# EAGLE design Motor-Shield_v11 (EAGLE 7.5.0)
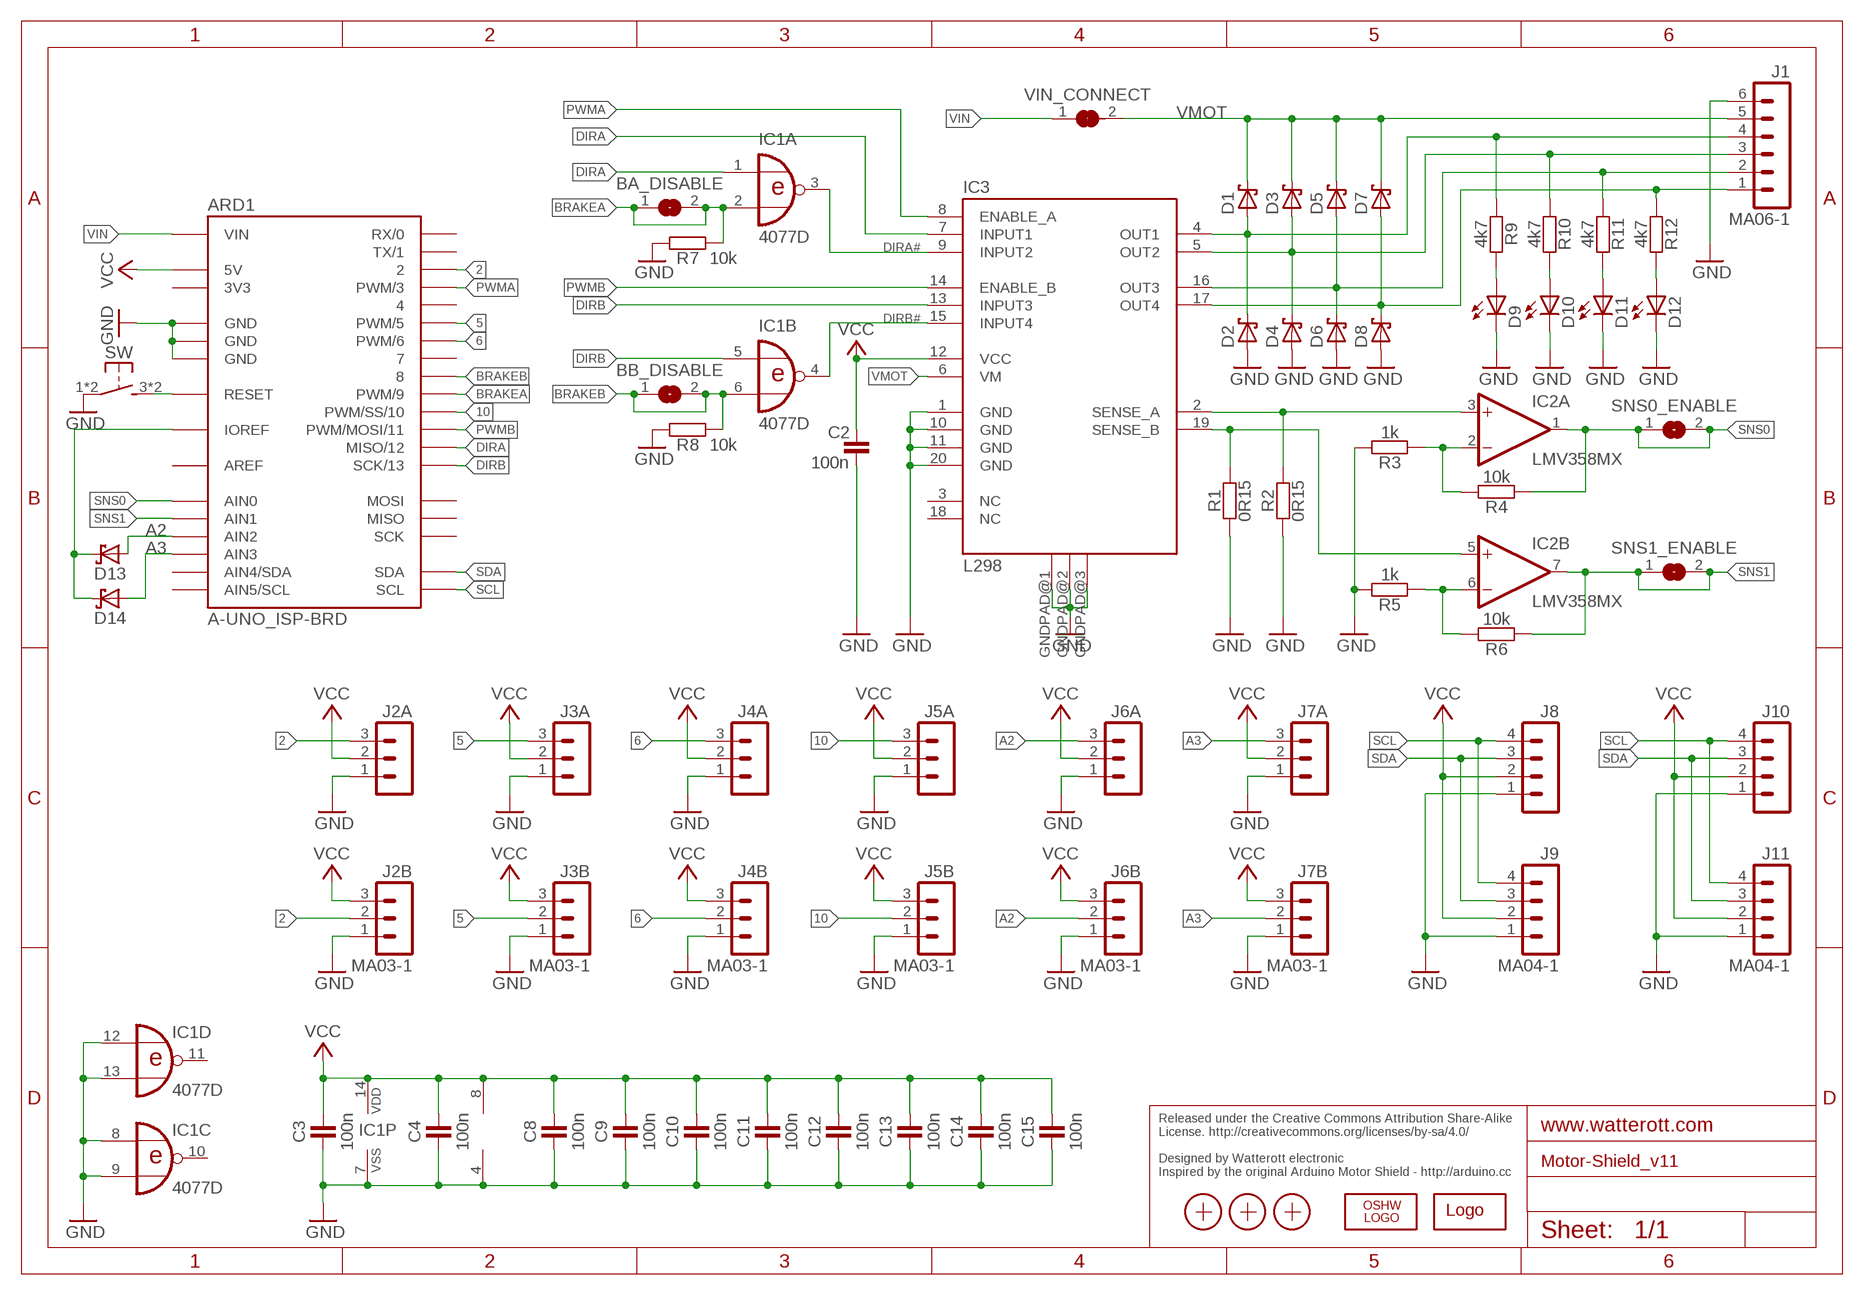
[diagram p0: schematic, sheet 1]

## Parts
ARD1  A-UNO_ISP-BRD  [A-UNO-ISP]
BA_DISABLE  JUMPER2-0603  [JUMPER2-0603]
BB_DISABLE  JUMPER2-0603  [JUMPER2-0603]
C2  100n  CAPACITOR-0402  [C0402]
C3  100n  CAPACITOR-0402  [C0402]
C4  100n  CAPACITOR-0402  [C0402]
C8  100n  CAPACITOR-0402  [C0402]
C9  100n  CAPACITOR-0402  [C0402]
C10  100n  CAPACITOR-0402  [C0402]
C11  100n  CAPACITOR-0402  [C0402]
C12  100n  CAPACITOR-0402  [C0402]
C13  100n  CAPACITOR-0402  [C0402]
C14  100n  CAPACITOR-0402  [C0402]
C15  100n  CAPACITOR-0402  [C0402]
D1  D_SS14  [DO214AC]
D2  D_SS14  [DO214AC]
D3  D_SS14  [DO214AC]
D4  D_SS14  [DO214AC]
D5  D_SS14  [DO214AC]
D6  D_SS14  [DO214AC]
D7  D_SS14  [DO214AC]
D8  D_SS14  [DO214AC]
D9  LED-0603  [C0603]
D10  LED-0603  [C0603]
D11  LED-0603  [C0603]
D12  LED-0603  [C0603]
D13  D_SCHOTTKY-SOD110  [SOD110]
D14  D_SCHOTTKY-SOD110  [SOD110]
IC1  4077D  [SO14]
IC2  LMV358MX  [SO08]
IC3  L298  [POWERSO20]
J1  MA06-1  [MA06-1]
J2A  JST_PH_3B3B-PH-SM4-TB  [JST_B3B-PH-SM4-TB]
J2B  MA03-1  [MA03-1]
J3A  JST_PH_3B3B-PH-SM4-TB  [JST_B3B-PH-SM4-TB]
J3B  MA03-1  [MA03-1]
J4A  JST_PH_3B3B-PH-SM4-TB  [JST_B3B-PH-SM4-TB]
J4B  MA03-1  [MA03-1]
J5A  JST_PH_3B3B-PH-SM4-TB  [JST_B3B-PH-SM4-TB]
J5B  MA03-1  [MA03-1]
J6A  JST_PH_3B3B-PH-SM4-TB  [JST_B3B-PH-SM4-TB]
J6B  MA03-1  [MA03-1]
J7A  JST_PH_3B3B-PH-SM4-TB  [JST_B3B-PH-SM4-TB]
J7B  MA03-1  [MA03-1]
J8  JST_PH_4B4B-PH-SM4-TB  [JST_B4B-PH-SM4-TB]
J9  MA04-1  [MA04-1]
J10  JST_PH_4B4B-PH-SM4-TB  [JST_B4B-PH-SM4-TB]
J11  MA04-1  [MA04-1]
LOGO1  LOGO-S_PLACE_S  [SPARK_TPLACE_S]
LOGO2  OSHW_LOGOX0070  [OSHW_6X70]
R1  0R15  RESISTOR-1206  [C1206]
R2  0R15  RESISTOR-1206  [C1206]
R3  1k  RESISTOR-0402  [C0402]
R4  10k  RESISTOR-0402  [C0402]
R5  1k  RESISTOR-0402  [C0402]
R6  10k  RESISTOR-0402  [C0402]
R7  10k  RESISTOR-0402  [C0402]
R8  10k  RESISTOR-0402  [C0402]
R9  4k7  RESISTOR-0402  [C0402]
R10  4k7  RESISTOR-0402  [C0402]
R11  4k7  RESISTOR-0402  [C0402]
R12  4k7  RESISTOR-0402  [C0402]
SNS0_ENABLE  JUMPER2-0603  [JUMPER2-0603]
SNS1_ENABLE  JUMPER2-0603  [JUMPER2-0603]
SW  SW-TACTILE-6X6_SMD  [SW6X6_SMD]
VIN_CONNECT  JUMPER2-0603  [JUMPER2-0603]
X1  PASSER-07  [PASSER_07MM]
X2  PASSER-07  [PASSER_07MM]
X3  PASSER-07  [PASSER_07MM]

## Nets
2: ARD1.2 J2A.3 J2B.2
5: ARD1.5(PWM/5) J3A.3 J3B.2
6: ARD1.6(PWM/6) J4A.3 J4B.2
10: ARD1.10(PWM/SS/10) J5A.3 J5B.2
A2: ARD1.A2(AIN2) D13.A J6A.3 J6B.2
A3: ARD1.A3(AIN3) D14.A J7A.3 J7B.2
BRAKEA: ARD1.9(PWM/9) BA_DISABLE.1 BA_DISABLE.2 IC1.2(A:I1) R7.1
BRAKEB: ARD1.8 BB_DISABLE.1 BB_DISABLE.2 IC1.6(B:I1) R8.1
DIRA: ARD1.12(MISO/12) IC1.1(A:I0) IC3.7(INPUT1)
DIRA#: IC1.3(A:O) IC3.9(INPUT2)
DIRB: ARD1.13(SCK/13) IC1.5(B:I0) IC3.13(INPUT3)
DIRB#: IC1.4(B:O) IC3.15(INPUT4)
GND: ARD1.GND@1(GND) ARD1.GND@2(GND) ARD1.GND@3(GND) ARD1.GND@4(GND) C2.1 C3.1 C4.1 C8.1 C9.1 C10.1 C11.1 C12.1 C13.1 C14.1 C15.1 D2.1(A) D4.1(A) D6.1(A) D8.1(A) D9.C D10.C D11.C D12.C IC1.7(P:VSS) IC1.8(C:I0) IC1.9(C:I1) IC1.12(D:I0) IC1.13(D:I1) IC2.4(P:V-) IC3.1(GND) IC3.10(GND) IC3.11(GND) IC3.20(GND) IC3.GNDPAD@1(GNDPAD) IC3.GNDPAD@2(GNDPAD) IC3.GNDPAD@3(GNDPAD) J1.6 J2A.1 J2B.1 J3A.1 J3B.1 J4A.1 J4B.1 J5A.1 J5B.1 J6A.1 J6B.1 J7A.1 J7B.1 J8.1 J9.1 J10.1 J11.1 R1.1 R2.1 R3.2 R5.2 R7.2 R8.2 SW.1 SW.2(P1)
IOREF: ARD1.IOREF D13.C D14.C
N$1: D9.A R9.2
N$2: D10.A R10.2
N$3: IC2.2(A:-IN) R3.1 R4.2
N$12: IC2.6(B:-IN) R5.1 R6.2
N$13: D11.A R11.2
N$14: D12.A R12.2
N$19: ARD1.RST@1(RESET) ARD1.RST@2(RESET) SW.3(S1) SW.4(S1)
OUT1: D1.1(A) D2.2(C) IC3.4(OUT1) J1.4 R9.1
OUT2: D3.1(A) D4.2(C) IC3.5(OUT2) J1.3 R10.1
OUT3: D5.1(A) D6.2(C) IC3.16(OUT3) J1.2 R11.1
OUT4: D7.1(A) D8.2(C) IC3.17(OUT4) J1.1 R12.1
PWMA: ARD1.3(PWM/3) IC3.8(ENABLE_A)
PWMB: ARD1.11(PWM/MOSI/11) IC3.14(ENABLE_B)
SCL: ARD1.SCL J8.4 J9.4 J10.4 J11.4
SDA: ARD1.SDA J8.3 J9.3 J10.3 J11.3
SENSE_A: IC2.3(A:+IN) IC3.2(SENSE_A) R2.2
SENSE_B: IC2.5(B:+IN) IC3.19(SENSE_B) R1.2
SNS0: ARD1.A0(AIN0) IC2.1(A:OUT) R4.1 SNS0_ENABLE.1 SNS0_ENABLE.2
SNS1: ARD1.A1(AIN1) IC2.7(B:OUT) R6.1 SNS1_ENABLE.1 SNS1_ENABLE.2
VCC: ARD1.5V ARD1.VCC(5V) C2.2 C3.2 C4.2 C8.2 C9.2 C10.2 C11.2 C12.2 C13.2 C14.2 C15.2 IC1.14(P:VDD) IC2.8(P:V+) IC3.12(VCC) J2A.2 J2B.3 J3A.2 J3B.3 J4A.2 J4B.3 J5A.2 J5B.3 J6A.2 J6B.3 J7A.2 J7B.3 J8.2 J9.2 J10.2 J11.2
VIN: ARD1.VIN VIN_CONNECT.1
VMOT: D1.2(C) D3.2(C) D5.2(C) D7.2(C) IC3.6(VM) J1.5 VIN_CONNECT.2
Unconnected: ARD1.0(RX/0) ARD1.1(TX/1) ARD1.4 ARD1.7 ARD1.A4(AIN4/SDA) ARD1.A5(AIN5/SCL) ARD1.MISO ARD1.MOSI ARD1.SCK IC1.10(C:O) IC1.11(D:O) IC3.3(NC) IC3.18(NC)

## Notes on the sheet
- Released under the Creative Commons Attribution Share-Alike 
  License. http://creativecommons.org/licenses/by-sa/4.0/
  
  Designed by Watterott electronic
  Inspired by the original Arduino Motor Shield - http://arduino.cc

## Power pins joined to a net without a drawn wire
3V3: ARD1.3V3
AREF: ARD1.AREF

## Library data of the parts
ARD1 = we-board:A-UNO_ISP: Arduino Uno with ISP connector
BA_DISABLE BB_DISABLE SNS0_ENABLE SNS1_ENABLE VIN_CONNECT = we-rcl:JUMPER2: 2 Pin Jumpers
C2-C4 C8-C15 = we-rcl:CAPACITOR: Capacitors ...4.7uF @ 6.3V -> 0402 ...10uF @ 16V -> 0603 ...22uF @ 25V -> 0805
D1-D8 = we-rcl:D_SS14: DIODE schottky
D9-D12 = we-opto:LED: LEDs red, green, blue -> 0603
D13 D14 = we-rcl:D_SCHOTTKY: Schottky Diodes
IC1 = 40xx:4077: Quad XNOR
IC2 = linear:LMV358?*: Dual General Purpose, Low Voltage, Rail-to-Rail Output Operational Amplifiers Source: http://www.national.com/mpf/LM/LMV321.html http://www.national.com/dt/lmv_qual.pdf
IC3 = we-chip:L298: ST L298 Dual Full Bridge Driver (up to 46V and 4A)
J1 = we-con:MA06-1: Pin Header
J2A J3A J4A J5A J6A J7A = we-con:JST_PH_3: JST Connector
J2B J3B J4B J5B J6B J7B = we-con:MA03-1: Pin Header
J8 J10 = we-con:JST_PH_4: JST Connector
J9 J11 = we-con:MA04-1: Pin Header
LOGO1 = we-symbol:LOGO: Watterott electronic Logo
LOGO2 = we-symbol:OSHW_LOGO: Open-Source-Hardware Logo
R1-R12 = we-rcl:RESISTOR: Resistors all kinds in 0603 and 0402
SW = we-switch:SW-TACTILE: Tactile Switches
X1-X3 = we-symbol:PASSER: Fiducial Markers

## Board
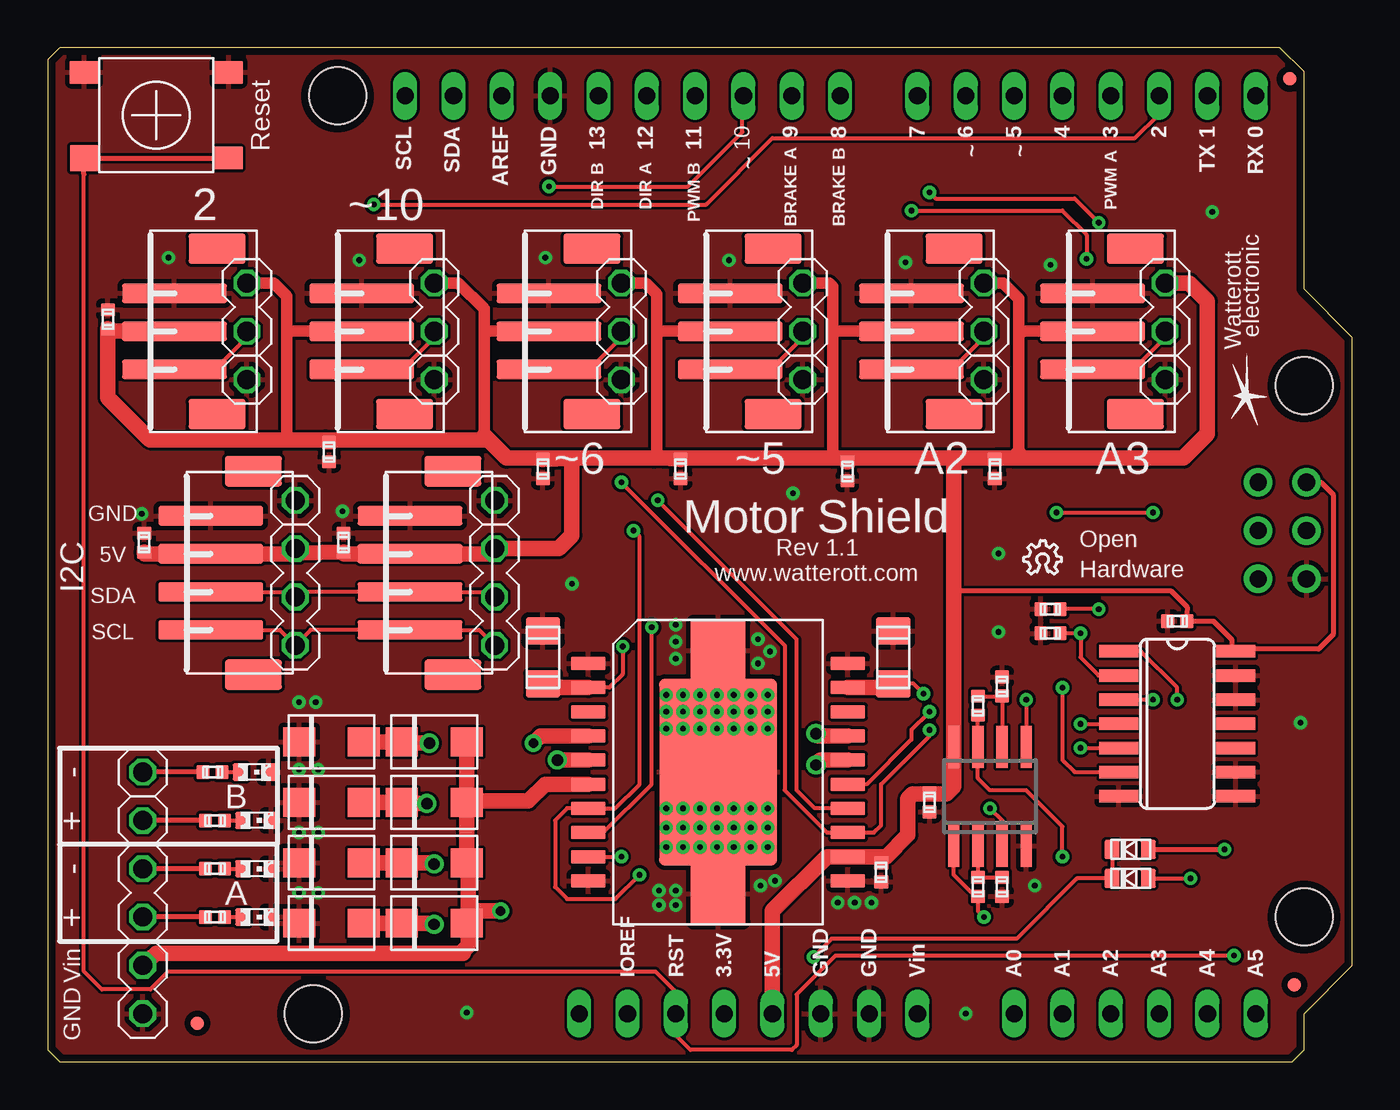
[diagram p1: board, top side]
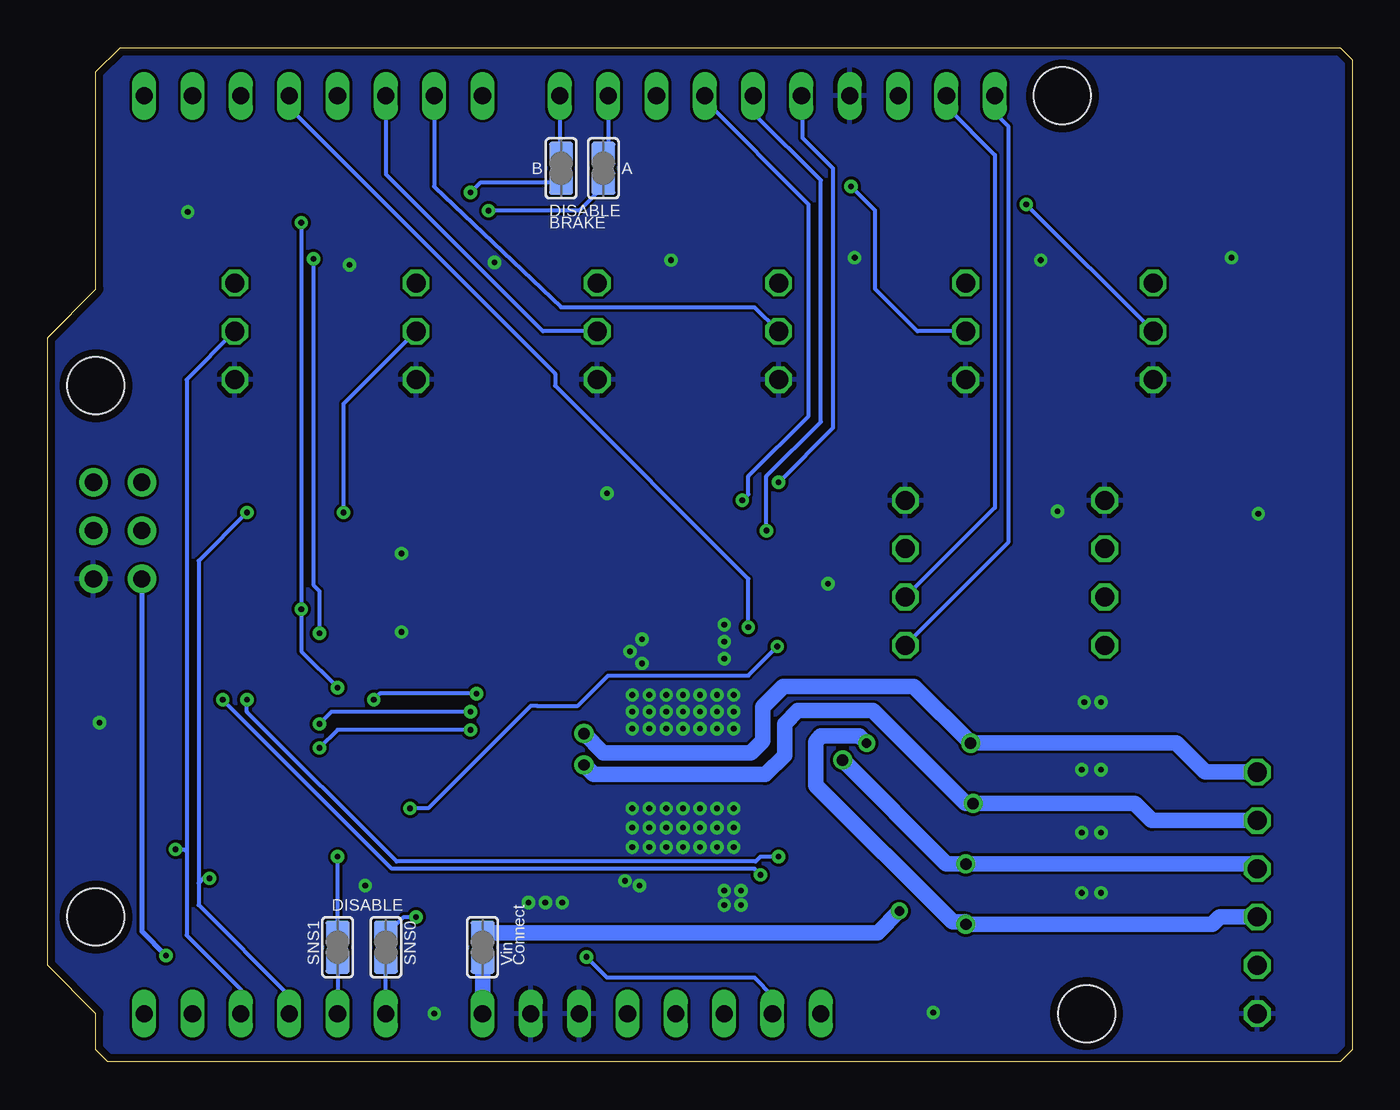
[diagram p2: board, bottom side, seen from below]

Size 68.58 x 53.34 mm. Coordinates in mm from the lower left corner, seen from the top.
Copper layers (1*16): Top 0.035mm / dielectric 1.5mm / Bottom 0.035mm
Design rules "we-dru-2-layer": minimum track width 0.15mm, minimum drill 0.3mm, track to track 0.15mm, track to pad 0.15mm, pad to pad 0.15mm, via to via 0.15mm, smd to smd 0.1mm, copper to edge 0.4mm, drill to drill 0.2mm, minimum pad ring 0.18mm, minimum via ring 0.2mm, stop-mask expansion 0.1mm, vias tented up to drill 0.5mm, thermal gap 0.25mm

### Footprints (pad centres in the part's own frame; a part is rotated, then mirrored left to right if it is on the bottom)
A-UNO-ISP = drill 0.9 pad 1.2 long: 0 63.5,50.8; 1 60.96,50.8; 2 58.42,50.8; 3 55.88,50.8; 3V3 35.56,2.54; 4 53.34,50.8; 5 50.8,50.8; 5V 38.1,2.54; 6 48.26,50.8; 7 45.72,50.8; 8 41.656,50.8; 9 39.116,50.8; 10 36.576,50.8; 11 34.036,50.8; 12 31.496,50.8; 13 28.956,50.8; A0 50.8,2.54; A1 53.34,2.54; A2 55.88,2.54; A3 58.42,2.54; A4 60.96,2.54; A5 63.5,2.54; AREF 23.876,50.8; GND@1 40.64,2.54; GND@2 43.18,2.54; GND@3 26.416,50.8; IOREF 30.48,2.54; NC 27.94,2.54; RST@1 33.02,2.54; SCL 18.796,50.8; SDA 21.336,50.8; VIN 45.72,2.54 | drill 0.9 pad 1.5: GND@4 66.167,25.4; MISO 63.627,30.48; MOSI 66.167,27.94; RST@2 63.627,25.4; SCK 63.627,27.94; VCC 66.167,30.48 | hole 3: 66.04,35.56; 66.04,7.62; 15.24,50.8; 13.97,2.54
JUMPER2-0603 = smd 1.25 x 1.25: 1 0,0.76; 2 0,-0.76
C0402 = smd 0.75 x 0.7: 1 0,0.5; 2 0,-0.5
DO214AC = smd 1.68 x 1.52: 1 -1.7,0; 2 1.7,0
C0603 = smd 0.9 x 0.8: A 0,-0.75; C 0,0.75
SOD110 = smd 1 x 0.8: A 0,-0.95; C 0,0.95
SO14 = smd 0.66 x 2.032: 1 -3.81,-3.073; 2 -2.54,-3.073; 3 -1.27,-3.073; 4 0,-3.073; 5 1.27,-3.073; 6 2.54,-3.073; 7 3.81,-3.073; 8 3.81,3.073; 9 2.54,3.073; 10 1.27,3.073; 11 0,3.073; 12 -1.27,3.073; 13 -2.54,3.073; 14 -3.81,3.073
SO08 = smd 0.6 x 2.2: 1 -1.905,-2.6; 2 -0.635,-2.6; 3 0.635,-2.6; 4 1.905,-2.6; 5 1.905,2.6; 6 0.635,2.6; 7 -0.635,2.6; 8 -1.905,2.6
POWERSO20 = smd 1.8 x 0.7: 1 -6.82,5.715; 2 -6.82,4.445; 3 -6.82,3.175; 4 -6.82,1.905; 5 -6.82,0.635; 6 -6.82,-0.635; 7 -6.82,-1.905; 8 -6.82,-3.175; 9 -6.82,-4.445; 10 -6.82,-5.715; 11 6.82,-5.715; 12 6.82,-4.445; 13 6.82,-3.175; 14 6.82,-1.905; 15 6.82,-0.635; 16 6.82,0.635; 17 6.82,1.905; 18 6.82,3.175; 19 6.82,4.445; 20 6.82,5.715 | smd 2.9 x 3.25: GNDPAD@1 0,6.4; GNDPAD@3 0,-6.4 | smd 6.2 x 9.8: GNDPAD@2 0,0
MA06-1 = drill 1 octagon: 1 0,6.35; 2 0,3.81; 3 0,1.27; 4 0,-1.27; 5 0,-3.81; 6 0,-6.35
JST_B3B-PH-SM4-TB = smd 5.5 x 1: 1 0,2; 2 0,0; 3 0,-2 | smd 3 x 1.6: SHLD1 2.25,4.35; SHLD2 2.25,-4.35
MA03-1 = drill 1 octagon: 1 0,2.54; 2 0,0; 3 0,-2.54
JST_B4B-PH-SM4-TB = smd 5.5 x 1: 1 0,3; 2 0,1; 3 0,-1; 4 0,-3 | smd 3 x 1.6: SHLD1 2.25,5.35; SHLD2 2.25,-5.35
MA04-1 = drill 1 octagon: 1 0,3.81; 2 0,1.27; 3 0,-1.27; 4 0,-3.81
C1206 = smd 1.8 x 1.45: 1 0,1.4; 2 0,-1.4
SW6X6_SMD = smd 1.5 x 1.2: 1 -3.8,2.25; 2 3.8,2.25; 4 3.8,-2.25 | smd 1.5 x 1.4: 3 -3.8,-2.25
PASSER_07MM = smd 0.7 x 0.7: X 0,0

### Placement (x,y rotation side)
ARD1  0,0 0 top
BA_DISABLE  39.37,46.99 180 bottom
BB_DISABLE  41.59,46.99 0 bottom
C2  43.81,9.97 180 top
C3  59.37,23.18 90 top
C4  46.35,13.65 180 top
C8  26.04,31.18 180 top
C9  33.27,31.18 180 top
C10  42.04,31.05 180 top
C11  49.78,31.18 180 top
C12  5.08,27.3 0 top
C13  15.56,27.3 0 top
C14  14.8,32.07 180 top
C15  3.17,39.05 0 top
D1  20.32,7.3 0 top
D2  14.92,7.3 0 top
D3  20.32,10.48 0 top
D4  14.92,10.48 0 top
D5  20.32,13.65 0 top
D6  14.92,13.65 0 top
D7  20.32,16.83 0 top
D8  14.92,16.83 0 top
D9  11,7.62 270 top
D10  11,10.16 270 top
D11  11,12.7 270 top
D12  10.87,15.24 270 top
D13  56.9,9.65 90 top
D14  56.9,11.18 90 top
IC1  59.37,17.78 270 top
IC2  49.53,13.97 0 top
IC3  35.24,15.24 0 top
J1  5,8.89 0 top
J2A  6.67,38.42 0 top
J2B  10.48,38.42 180 top
J3A  35.88,38.42 0 top
J3B  39.69,38.42 180 top
J4A  26.35,38.42 0 top
J4B  30.16,38.42 180 top
J5A  16.51,38.42 0 top
J5B  20.32,38.42 180 top
J6A  45.4,38.42 0 top
J6B  49.21,38.42 180 top
J7A  54.93,38.42 0 top
J7B  58.74,38.42 180 top
J8  8.57,25.72 0 top
J9  13.02,25.72 0 top
J10  19.05,25.72 0 top
J11  23.5,25.72 0 top
LOGO1  62.99,35.05 90 top
LOGO2  51.31,25.65 0 top
R1  44.45,21.27 0 top
R2  26.04,21.27 0 top
R3  50.16,9.21 0 top
R4  48.9,9.21 180 top
R5  50.16,19.75 180 top
R6  48.9,18.73 180 top
R7  52.7,22.54 270 top
R8  52.7,23.81 270 top
R9  8.8,7.62 90 top
R10  8.8,10.16 90 top
R11  8.8,12.7 90 top
R12  8.67,15.24 90 top
SNS0_ENABLE  50.8,6.03 0 bottom
SNS1_ENABLE  53.34,6.03 0 bottom
SW  5.71,49.78 0 top
VIN_CONNECT  45.72,6.03 180 bottom
X1  7.87,2.03 0 top
X2  65.53,4.06 0 top
X3  65.28,51.69 0 top

### Tracks (layer width: path | path; a pad name or v marks a point on that pad's centre or on a via)
2  (via drill 0.3)
  Top 0.2: v17.14,45.09 34.61,45.09 38.1,48.58 57.15,48.58 58.42,49.85 ARD1.2 | J2A.3 8.79,36.42 10.16,37.78 10.16,38.1 J2B.2
  Bottom 0.2: J2B.2 v17.14,45.09
5
  Top 0.2: J3A.3 38.01,36.42 39.37,37.78 39.37,38.1 J3B.2
  Bottom 0.2: ARD1.5 50.8,46.67 42.55,38.42 J3B.2
6
  Top 0.2: J4A.3 28.48,36.42 29.84,37.78 29.84,38.1 J4B.2
  Bottom 0.2: ARD1.6 48.26,46.04 41.59,39.69 31.43,39.69 J4B.2
10  (via drill 0.3)
  Top 0.2: v26.35,46.04 33.66,46.04 36.51,48.9 36.51,50.74 ARD1.10 | J5A.3 18.64,36.42 20,37.78 20,38.1 J5B.2
  Bottom 0.2: v26.35,46.04 25.08,44.77 25.08,40.64 22.86,38.42 J5B.2
A2  (via drill 0.3)
  Top 0.2: v53.02,28.89 v58.1,28.89 | J6A.3 47.53,36.42 48.9,37.78 48.9,38.1 J6B.2 | D13.A v60.07,9.65
  Bottom 0.2: v58.1,28.89 60.64,26.35 60.64,9.4 | 60.64,9.4 60.64,8.26 55.88,3.49 ARD1.A2 | v53.02,28.89 53.02,34.61 J6B.2 | v60.07,9.65 60.39,9.65 60.64,9.4
A3  (via drill 0.3)
  Top 0.2: J7A.3 57.05,36.42 58.42,37.78 58.42,38.1 J7B.2
  Top 0.254: D14.A v61.85,11.18
  Bottom 0.2: 61.28,11.05 61.28,35.88 J7B.2 | 61.28,11.05 61.28,6.67 58.42,3.81 ARD1.A3 | v61.85,11.18 61.4,11.18 61.28,11.05
BRAKEA  (via drill 0.3)
  Top 0.2: v45.4,44.77 53.34,44.77 54.61,43.5 v54.61,42.23 | IC1.2 55.24,20.32 54.29,21.27 v54.29,22.54 R7.1
  Bottom 0.2: ARD1.9 39.12,48 BA_DISABLE.2 BA_DISABLE.1 39.37,46.04 40.64,44.77 v45.4,44.77 | v54.61,42.23 54.61,25.08 54.29,24.77 v54.29,22.54
BRAKEB  (via drill 0.3)
  Top 0.2: v46.35,45.72 46.67,45.4 53.98,45.4 v55.24,44.13 | v53.34,19.68 53.34,15.88 53.98,15.24 IC1.6 | v55.24,23.81 R8.1
  Bottom 0.2: ARD1.8 41.66,47.81 BB_DISABLE.1 BB_DISABLE.2 45.84,46.23 v46.35,45.72 | v55.24,44.13 v55.24,23.81 55.24,21.59 v53.34,19.68
DIRA  (via drill 0.3)
  Top 0.2: v31.11,9.84 29.84,8.57 27.3,8.57 26.67,9.21 26.67,12.7 27.3,13.34 IC3.7 29.84,13.34 31.11,14.61 31.11,27.62 v30.8,27.94 | v59.37,19.05 59.37,19.68 57.47,21.59 IC1.1
  Bottom 0.2: v31.11,9.84 31.43,10.16 50.48,10.16 v59.37,19.05 | v30.8,27.94 30.8,30.8 27.94,33.66 27.94,46.35 31.43,49.85 31.43,50.74 ARD1.12
DIRA#  (via drill 0.3)
  Top 0.2: IC3.9 v30.16,10.79 | v58.1,19.05 IC1.3
  Bottom 0.2: v58.1,19.05 58.1,18.41 50.23,10.54 31.37,10.54 31.11,10.79 v30.16,10.79
DIRB  (via drill 0.3)
  Top 0.2: v46.35,17.46 46.35,17.14 43.81,14.61 43.81,12.45 43.43,12.06 IC3.13 40.96,12.06 38.73,14.29 38.73,21.91 v30.16,30.48 | v54.29,16.51 IC1.5
  Bottom 0.2: v46.35,17.46 53.34,17.46 v54.29,16.51 | v30.16,30.48 27.3,33.34 27.3,46.99 28.89,48.58 28.89,50.74 ARD1.13
DIRB#  (via drill 0.3)
  Top 0.2: v46.35,18.41 45.4,17.46 45.4,16.95 43.05,14.61 IC3.15 | v54.29,17.78 IC1.4
  Bottom 0.2: v46.35,18.41 53.66,18.41 v54.29,17.78
GND  (via drill 0.3)
  other vias: 13.21,18.92 14.1,18.92 13.21,15.37 14.22,15.37 13.21,12.06 14.22,12.06 13.21,8.89 14.22,8.89 33.02,9.02 33.02,8.26 37.47,9.27 32.13,9.02 32.13,8.26 38.23,9.53 41.53,8.38 42.42,8.38 43.31,8.38 33.02,21.21 33.02,22.1 33.02,22.99 37.34,22.23 37.34,20.95 37.97,21.59 32.51,11.3 33.4,11.3 34.29,11.3 35.18,11.3 36.07,11.3 36.96,11.3 37.85,11.3 32.51,12.32 33.4,12.32 34.29,12.32 35.18,12.32 36.07,12.32 36.96,12.32 37.85,12.32 32.51,13.34 33.4,13.34 34.29,13.34 35.18,13.34 36.07,13.34 36.96,13.34 37.85,13.34 32.51,19.3 33.4,19.3 34.29,19.3 35.18,19.3 36.07,19.3 36.96,19.3 37.85,19.3 32.51,18.41 33.4,18.41 34.29,18.41 35.18,18.41 36.07,18.41 36.96,18.41 37.85,18.41 32.51,17.53 33.4,17.53 34.29,17.53 35.18,17.53 36.07,17.53 36.96,17.53 37.85,17.53 4.95,28.83 15.49,28.96 6.35,42.29 16.38,42.16 26.16,42.29 35.81,42.16 45.09,42.04 52.7,41.91 39.18,29.91 49.97,26.73 49.97,22.61 65.85,17.84 22.03,2.6 61.21,44.7 51.88,9.27 27.56,25.15 48.26,2.54
  pour Bottom: 0.64,53.34 64.77,53.34 66.04,52.07 66.04,40.64 68.58,38.1 68.58,5.08 66.04,2.54 66.04,0.64 65.41,0 0.64,0 0,0.64 0,52.7
  pour Top: 0.64,53.34 64.77,53.34 66.04,52.07 66.04,40.64 68.58,38.1 68.58,5.08 66.04,2.54 66.04,0.64 65.41,0 0.64,0 0,0.64 0,52.7
IOREF  (via drill 0.3)
  Top 0.2: D14.C D13.C 54.1,9.65 50.93,6.48 41.21,6.48 v40.26,5.52
  Bottom 0.2: v40.26,5.52 39.18,4.45 31.43,4.45 30.48,3.49 ARD1.IOREF
N$1
  Top 0.2: R9.2 D9.A
N$2
  Top 0.2: R10.2 D10.A
N$3
  Top 0.2: IC2.2 R4.2 R3.1
N$10
  Bottom 0.61: 45.72,6.67 45.72,5.4
N$12
  Top 0.2: IC2.6 R5.1 50.15,19.23 R6.2
N$13
  Top 0.2: R11.2 D11.A
N$14
  Top 0.2: R12.2 D12.A
N$19  (via drill 0.3)
  Top 0.2: 1.91,46.67 1.91,4.76 2.86,3.81 5.4,3.81 6.35,4.76 31.94,4.76 33.02,3.68 ARD1.RST@1 33.02,1.4 33.78,0.64 39.12,0.64 39.37,0.89 39.37,3.56 41.4,5.59 v62.36,5.59
  Top 0.254: 1.91,46.67 1.91,47.52 SW.3 SW.4
  Bottom 0.254: ARD1.RST@2 63.63,6.86 v62.36,5.59
OUT1  (via drill 0.5, 0.6)
  Top 0.254: R9.1 J1.4
  Top 0.813: D2.2 D1.1 20.26,7.3 v20.32,7.24 | IC3.4 25.91,17.14 v25.53,16.76
  Bottom 0.813: J1.4 6.99,7.62 7.37,7.24 v20.32,7.24 20.32,7.37 21.02,7.37 28.19,14.54 28.19,16.83 27.94,17.14 25.91,17.14 v25.53,16.76
OUT2  (via drill 0.6)
  Top 0.254: R10.1 J1.3
  Top 0.813: D4.2 D3.1 20.26,10.48 v20.32,10.41 | IC3.5 v26.8,15.88
  Bottom 0.813: J1.3 5.25,10.41 v20.32,10.41 21.34,10.41 v26.8,15.88
OUT3  (via drill 0.6)
  Top 0.254: R11.1 J1.2
  Top 0.813: D6.2 D5.1 18.68,13.59 v19.94,13.59 | IC3.16 40.64,15.88 v40.39,15.62
  Bottom 0.813: J1.2 10.54,12.7 11.43,13.59 v19.94,13.59 20.32,13.59 25.21,18.48 29.15,18.48 29.84,17.78 29.84,16.13 30.86,15.11 39.88,15.11 v40.39,15.62
OUT4  (via drill 0.6)
  Top 0.254: R12.1 J1.1
  Top 0.813: D8.2 D7.1 18.68,16.76 v20.07,16.76 | IC3.17 40.51,17.14 v40.39,17.27
  Bottom 0.813: J1.1 7.75,15.24 9.27,16.76 v20.07,16.76 23.05,19.75 29.91,19.75 30.99,18.67 30.99,16.89 31.62,16.26 39.37,16.26 v40.39,17.27
PWMA  (via drill 0.3)
  Top 0.2: IC3.8 29.21,12.06 31.75,14.61 v31.75,22.86
  Bottom 0.2: ARD1.3 55.88,50.16 41.91,36.2 41.91,35.56 31.75,25.4 v31.75,22.86
PWMB  (via drill 0.3)
  Top 0.2: IC3.14 40.32,13.34 39.37,14.29 39.37,22.23 v32.07,29.53
  Bottom 0.2: v32.07,29.53 31.75,29.84 31.75,30.8 28.57,33.97 28.57,45.09 33.97,50.48 33.97,50.74 ARD1.11
SCL
  Top 0.2: J8.4 12.21,22.72 J9.4 13.83,22.72 J10.4 22.68,22.72 J11.4
  Bottom 0.2: J11.4 18.1,27.3 18.1,49.21 18.73,49.85 18.73,50.74 ARD1.SCL
SDA
  Top 0.2: J8.3 12.75,24.72 J9.3 13.29,24.72 J10.3 23.23,24.72 J11.3
  Bottom 0.2: 21.27,50.8 ARD1.SDA 21.27,50.74 21.27,50.16 18.8,47.69 18.8,29.15 J11.3
SENSE_A  (via drill 0.3)
  Top 0.2: 29.21,19.68 IC3.2 29.53,19.68 30.23,20.38 v30.23,21.84 | v49.53,13.34 50.16,12.7 IC2.3
  Top 0.813: IC3.2 26.27,19.68 R2.2
  Bottom 0.2: v49.53,13.34 48.58,13.34 43.18,18.73 42.86,18.73 40.7,18.73 39.12,20.32 31.75,20.32 v30.23,21.84
SENSE_B  (via drill 0.3)
  Top 0.2: R1.2 45.48,19.92 v46.04,19.37 | v51.44,19.05 IC2.5
  Top 0.813: IC3.19 44.21,19.68 R1.2
  Bottom 0.2: v46.04,19.37 51.12,19.37 v51.44,19.05
SNS0  (via drill 0.3)
  Top 0.2: IC2.1 47.62,9.84 48.81,8.66 R4.1 48.9,7.94 v49.21,7.62
  Bottom 0.2: ARD1.A0 SNS0_ENABLE.2 SNS0_ENABLE.1 50.67,6.79 49.85,7.62 v49.21,7.62
SNS1  (via drill 0.3)
  Top 0.2: R6.1 IC2.7 48.9,14.92 49.53,14.29 51.44,14.29 53.34,12.38 v53.34,10.79
  Bottom 0.2: ARD1.A1 SNS1_ENABLE.2 SNS1_ENABLE.1 v53.34,10.79
VCC
  Top 0.2: 47.94,24.77 47.62,25.08 | C4.2 45.9,14.15 45.85,14.1 | C2.2 43.81,10.67 43.94,10.79
  Top 0.254: 47.94,24.77 59.05,24.77 59.92,23.9 C3.2 61.28,23.18 62.23,22.23 62.23,21.81 IC1.14 62.57,21.72 66.8,21.72 67.56,22.48 67.56,29.84 66.93,30.48 ARD1.VCC
  Top 0.406: C14.2 14.61,32.57 14.61,32.7
  Top 0.61: 22.95,32.94 22.95,38.42 | 22.95,38.42 22.95,39.6 21.59,40.96 J5B.3 | J4A.2 22.95,38.42 | J3A.2 32.19,38.42 32,38.23 | 32,38.23 32,31.88 31.88,31.75 | J4B.3 31.43,40.96 32,40.39 32,38.23 | J3B.3 41.08,40.96 41.27,40.77 41.27,38.48 | 41.27,38.48 41.27,31.75 | J6A.2 41.34,38.42 41.27,38.48 | 49.76,31.75 C11.2 49.81,31.75 | J6B.3 50.23,40.96 51.05,40.13 51.05,38.23 | 51.05,38.23 51.05,32 | J7A.2 51.24,38.42 51.05,38.23 | J2B.3 11.87,40.96 12.57,40.26 12.57,38.35 | 12.57,38.35 12.57,32.7 | J5A.2 12.64,38.42 12.57,38.35
  Top 0.813: ARD1.5V 38.1,7.94 40.96,10.79 IC3.12 43.94,10.79 44.07,10.79 45.21,11.94 45.21,13.84 45.47,14.1 45.85,14.1 47.24,14.1 47.62,14.48 IC2.8 47.62,25.08 47.62,31.75 | 6.58,38.5 J2A.2 3.26,38.42 C15.2 3.17,34.92 5.4,32.7 12.57,32.7 14.61,32.7 23.18,32.7 | C12.2 5.12,26.72 J8.2 12.75,26.72 J9.2 13.25,26.75 C13.2 15.6,26.72 J10.2 23.23,26.72 J11.2 26.86,26.99 27.56,27.69 27.56,31.62 27.69,31.75 | 47.62,31.75 41.91,31.75 | 41.91,31.75 41.27,31.75 32.38,31.75 | 32.38,31.75 31.88,31.75 27.69,31.75 | 27.69,31.75 27.56,31.75 | 27.56,31.75 24.13,31.75 23.18,32.7 | C10.2 41.91,31.75 | C9.2 32.38,31.75 | 22.95,32.94 23.18,32.7 | 47.62,31.75 49.76,31.75 | 50.8,31.75 49.81,31.75 | C8.2 27.54,31.73 27.56,31.75 | 50.8,31.75 59.69,31.75 60.96,33.02 60.96,40.01 60.01,40.96 J7B.3 | 51.05,32 50.8,31.75
VIN
  Bottom 0.813: ARD1.VIN VIN_CONNECT.1
VMOT  (via drill 0.5)
  Top 0.813: J1.5 5.71,5.71 5.84,5.71 | 5.84,5.71 21.72,5.71 22.1,6.1 22.1,7.22 | 22.1,7.22 D1.2 | 22.1,7.22 22.1,7.87 | 22.1,7.87 22.1,10.4 D3.2 D5.2 | D5.2 D7.2 | IC3.6 26.16,14.61 25.27,13.72 22.08,13.72 D5.2 | v23.81,7.94 22.16,7.94 22.1,7.87 | 5.84,5.71 21.84,5.71
  Bottom 0.813: VIN_CONNECT.2 24.96,6.79 v23.81,7.94

### Text on the board
tPlace: Reset | SCL | SDA | AREF | GND | 13 | 12 | 11 | 10 | 9 | 8 | 7 | 6 | 5 | 4 | 3 | 2 | TX 1 | RX 0 | ~ | BRAKE A | BRAKE B | ~ | ~ | PWM A | DIR B | DIR A | PWM B | 2 | ~10 | electronic | Watterott | ~6 | ~5 | A2 | A3 | GND | Motor Shield | 5V | Rev 1.1 | Open | I2C | www.watterott.com | Hardware | SDA | SCL | - | B | + | - | A | + | Vin | IOREF | RST | 3.3V | 5V | GND | GND | Vin | A0 | A1 | A2 | A3 | A4 | A5 | GND
bNames: A | B | DISABLE | BRAKE | DISABLE | Connect | Vin | SNS0 | SNS1
Reference: Silkscreen: 21 tPlace